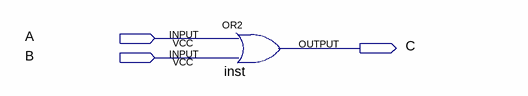
[diagram p0: schematic sheet]
// Quartus schematic OR_VHDL.bdf as structural Verilog: 1 symbols, 3 pins
module OR_VHDL (
  input  A,
  input  B,
  output C
);

  or inst (C, A, B);
endmodule
